# Altium schematic sheet uSDcard.SchDoc: uSD card interface
size A4; Author: Olexandr Gudozhnik; Organization: EPFL-STI-LIS; Address1: EPFL, Station 9; Address2: 1015 Lausanne; Address3: Switzerland; DocumentNumber: 6; SheetNumber: 6; SheetTotal: 8
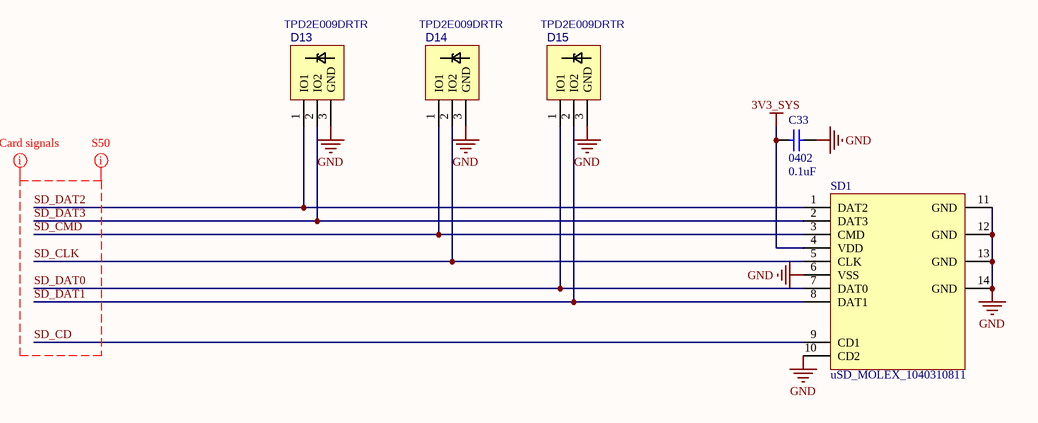
[diagram p0: uSDcard.SchDoc]

## Parts
C33  0402  value 0.1uF  [cap0402]
D13  TPD2E009DRTR  [SOT-3]
D14  TPD2E009DRTR  [SOT-3]
D15  TPD2E009DRTR  [SOT-3]
SD1  uSD_MOLEX_1040310811  [uSD_MOLEX_1040310811]

## Nets
3V3_SYS: C33.1 SD1.4(VDD)
GND: C33.2 D13.3(GND) D14.3(GND) D15.3(GND) SD1.6(VSS) SD1.10(CD2) SD1.11(GND) SD1.12(GND) SD1.13(GND) SD1.14(GND)
SD_CD: SD1.9(CD1)
SD_CLK: D14.2(IO2) SD1.5(CLK)
SD_CMD: D14.1(IO1) SD1.3(CMD)
SD_DAT0: D15.1(IO1) SD1.7(DAT0)
SD_DAT1: D15.2(IO2) SD1.8(DAT1)
SD_DAT2: D13.1(IO1) SD1.1(DAT2)
SD_DAT3: D13.2(IO2) SD1.2(DAT3)

## Layout directives
net class uSD: SD_CD, SD_CLK, SD_CMD, SD_DAT0, SD_DAT1, SD_DAT2, SD_DAT3
net class S50: SD_CD, SD_CLK, SD_CMD, SD_DAT0, SD_DAT1, SD_DAT2, SD_DAT3

## Notes on the sheet
- Author:
- Title
- Size:
- Date:
- A4
- Number:
- Sheet
- Revision:
- of
- File:

## Library data of the parts
C33 = cap: standard, non-polarized capacitor; Supplier 1: Digi-Key; Supplier Part Number 1: 490-14603-1-ND; Supplier Price 1: 0.08; Footprint verified: no
D13-D15 = TPD2E009: ESD Suppressors 2-CH; Manufacturer: Texas Instruments; PartNumber: TPD2E009DRTR; Value: TPD2E009DRTR; PartSymbol: TPD2E009DRTR; Supplier 1: Digi-Key; Supplier Part Number 1: 296-25410-1-ND
SD1 = uSD_MOLEX_1040310811: Supplier 1: Digi-Key; Supplier Part Number 1: WM6357CT-ND